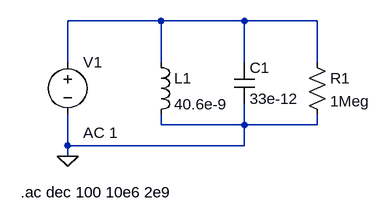
[diagram p0: schematic parallel-resonance.asc]
parallel-resonance.asc, the LTspice schematic file:
Version 4
SHEET 1 880 680
WIRE 208 48 64 48
WIRE 336 48 208 48
WIRE 448 48 336 48
WIRE 64 112 64 48
WIRE 208 112 208 48
WIRE 336 112 336 48
WIRE 448 112 448 48
WIRE 208 208 208 192
WIRE 336 208 336 176
WIRE 336 208 208 208
WIRE 448 208 448 192
WIRE 448 208 336 208
WIRE 64 240 64 192
WIRE 336 240 336 208
WIRE 336 240 64 240
WIRE 64 256 64 240
FLAG 64 256 0
SYMBOL ind 192 96 R0
SYMATTR InstName L1
SYMATTR Value 40.6e-9
SYMBOL cap 320 112 R0
SYMATTR InstName C1
SYMATTR Value 33e-12
SYMBOL voltage 64 96 R0
WINDOW 123 24 124 Left 2
WINDOW 39 0 0 Left 0
SYMATTR InstName V1
SYMATTR Value ""
SYMATTR Value2 AC 1
SYMBOL res 432 96 R0
SYMATTR InstName R1
SYMATTR Value 1Meg
TEXT -8 312 Left 2 !.ac dec 100 10e6 2e9

The netlist it stands for:
* parallel-resonance.asc
L1 N001 0 40.6e-9
C1 N001 0 33e-12
V1 N001 0 AC 1
R1 N001 0 1Meg
.ac dec 100 10e6 2e9
.backanno
.end